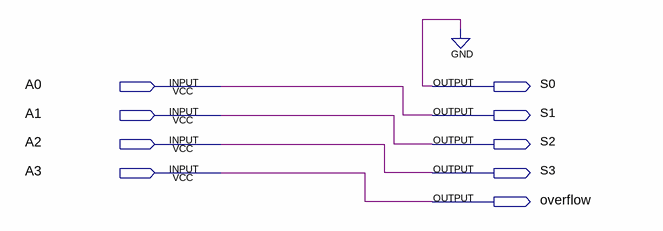
[diagram p0: schematic sheet]
// Quartus schematic multiplicador.bdf as structural Verilog: 0 symbols, 9 pins
module multiplicador (
  input  A0,
  input  A1,
  input  A2,
  input  A3,
  output S0,
  output S1,
  output S2,
  output S3,
  output overflow
);


  assign overflow = A3;
  assign S0 = 1'b0;
  assign S1 = A0;
  assign S2 = A1;
  assign S3 = A2;
endmodule
